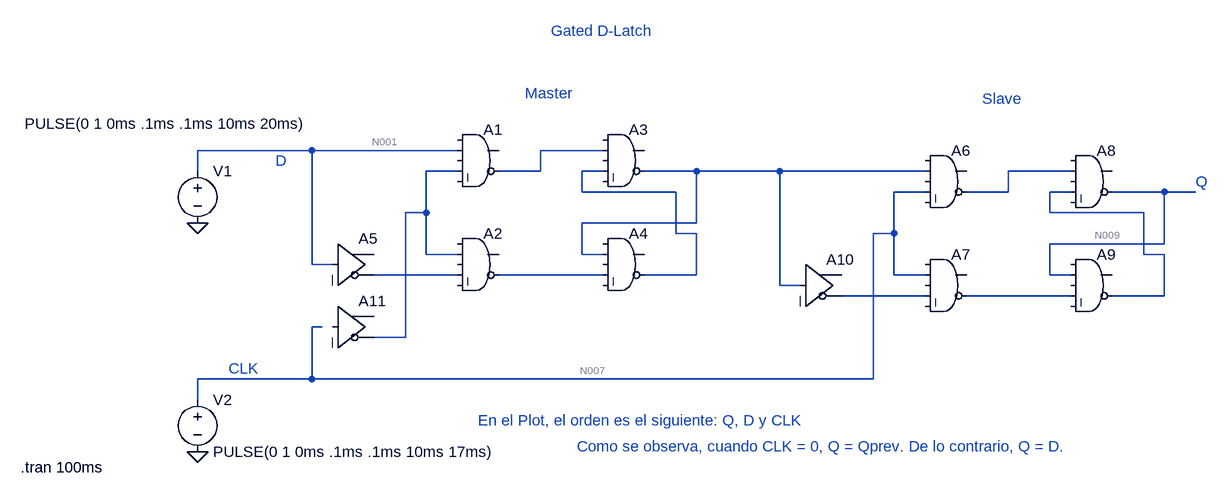
[diagram p0: schematic Lab_01_6.asc]
Lab_01_6.asc, the LTspice schematic file:
Version 4
SHEET 1 1204 680
WIRE -176 80 -352 80
WIRE 48 80 -176 80
WIRE 272 80 176 80
WIRE -352 112 -352 80
WIRE 48 112 0 112
WIRE 176 112 176 80
WIRE 176 112 112 112
WIRE 272 112 240 112
WIRE 416 112 336 112
WIRE 544 112 416 112
WIRE 768 112 544 112
WIRE 992 112 896 112
WIRE 240 144 240 112
WIRE 384 144 240 144
WIRE 768 144 720 144
WIRE 896 144 896 112
WIRE 896 144 832 144
WIRE 992 144 960 144
WIRE 1136 144 1056 144
WIRE 1184 144 1136 144
WIRE 0 176 0 112
WIRE 0 176 -32 176
WIRE 960 176 960 144
WIRE 1104 176 960 176
WIRE 416 192 416 112
WIRE 416 192 240 192
WIRE 384 208 384 144
WIRE 416 208 384 208
WIRE 720 208 720 144
WIRE 720 208 688 208
WIRE 1136 224 1136 144
WIRE 1136 224 960 224
WIRE 0 240 0 176
WIRE 48 240 0 240
WIRE 240 240 240 192
WIRE 272 240 240 240
WIRE 1104 240 1104 176
WIRE 1136 240 1104 240
WIRE -176 256 -176 80
WIRE -144 256 -176 256
WIRE 48 272 -80 272
WIRE 272 272 112 272
WIRE 416 272 416 208
WIRE 416 272 336 272
WIRE 720 272 720 208
WIRE 768 272 720 272
WIRE 960 272 960 224
WIRE 992 272 960 272
WIRE 544 288 544 112
WIRE 576 288 544 288
WIRE 768 304 640 304
WIRE 992 304 832 304
WIRE 1136 304 1136 240
WIRE 1136 304 1056 304
WIRE -160 352 -176 352
WIRE -32 368 -32 176
WIRE -32 368 -80 368
WIRE -176 432 -176 352
WIRE -176 432 -352 432
WIRE 688 432 688 208
WIRE 688 432 -176 432
WIRE -352 464 -352 432
FLAG -352 192 0
FLAG -352 544 0
SYMBOL Digital\\and 80 32 R0
SYMATTR InstName A1
SYMBOL Digital\\and 80 192 R0
SYMATTR InstName A2
SYMBOL Digital\\and 304 32 R0
SYMATTR InstName A3
SYMBOL Digital\\and 304 192 R0
SYMATTR InstName A4
SYMBOL Digital\\buf -144 192 R0
SYMATTR InstName A5
SYMBOL Digital\\and 800 64 R0
SYMATTR InstName A6
SYMBOL Digital\\and 800 224 R0
SYMATTR InstName A7
SYMBOL Digital\\and 1024 64 R0
SYMATTR InstName A8
SYMBOL Digital\\and 1024 224 R0
SYMATTR InstName A9
SYMBOL Digital\\buf 576 224 R0
SYMATTR InstName A10
SYMBOL voltage -352 96 R0
WINDOW 3 -266 -57 Left 2
WINDOW 123 0 0 Left 0
WINDOW 39 0 0 Left 0
SYMATTR Value PULSE(0 1 0ms .1ms .1ms 10ms 20ms)
SYMATTR InstName V1
SYMBOL voltage -352 448 R0
WINDOW 123 0 0 Left 0
WINDOW 39 0 0 Left 0
SYMATTR InstName V2
SYMATTR Value PULSE(0 1 0ms .1ms .1ms 10ms 17ms)
SYMBOL Digital\\buf -144 288 R0
SYMATTR InstName A11
TEXT 1184 128 Left 2 ;Q
TEXT -232 96 Left 2 ;D
TEXT -304 416 Left 2 ;CLK
TEXT 152 -8 Left 2 ;Master
TEXT 856 0 Left 2 ;Slave
TEXT -624 568 Left 2 !.tran 100ms
TEXT 80 496 Left 2 ;En el Plot, el orden es el siguiente: Q, D y CLK
TEXT 192 -104 Left 2 ;Gated D-Latch
TEXT 232 536 Left 2 ;Como se observa, cuando CLK = 0, Q = Qprev. De lo contrario, Q = D.

The netlist it stands for:
* Lab_01_6.asc
A1 0 N001 0 N003 0 N002 0 0 AND
A2 0 N003 0 N010 0 N011 0 0 AND
A3 0 N002 0 N004 0 N005 0 0 AND
A4 0 N005 0 N011 0 N004 0 0 AND
A5 N001 0 0 0 0 N010 0 0 BUF
A6 0 N005 0 N007 0 N006 0 0 AND
A7 0 N007 0 N012 0 N013 0 0 AND
A8 0 N006 0 N008 0 N009 0 0 AND
A9 0 N009 0 N013 0 N008 0 0 AND
A10 N005 0 0 0 0 N012 0 0 BUF
V1 N001 0 PULSE(0 1 0ms .1ms .1ms 10ms 20ms)
V2 N007 0 PULSE(0 1 0ms .1ms .1ms 10ms 17ms)
A11 0 0 0 0 0 N003 0 0 BUF
* Q
* D
* CLK
* Master
* Slave
.tran 100ms
* En el Plot, el orden es el siguiente: Q, D y CLK
* Gated D-Latch
* Como se observa, cuando CLK = 0, Q = Qprev. De lo contrario, Q = D.
.backanno
.end

* Results of the author's LTspice run, read from the files saved beside the schematic
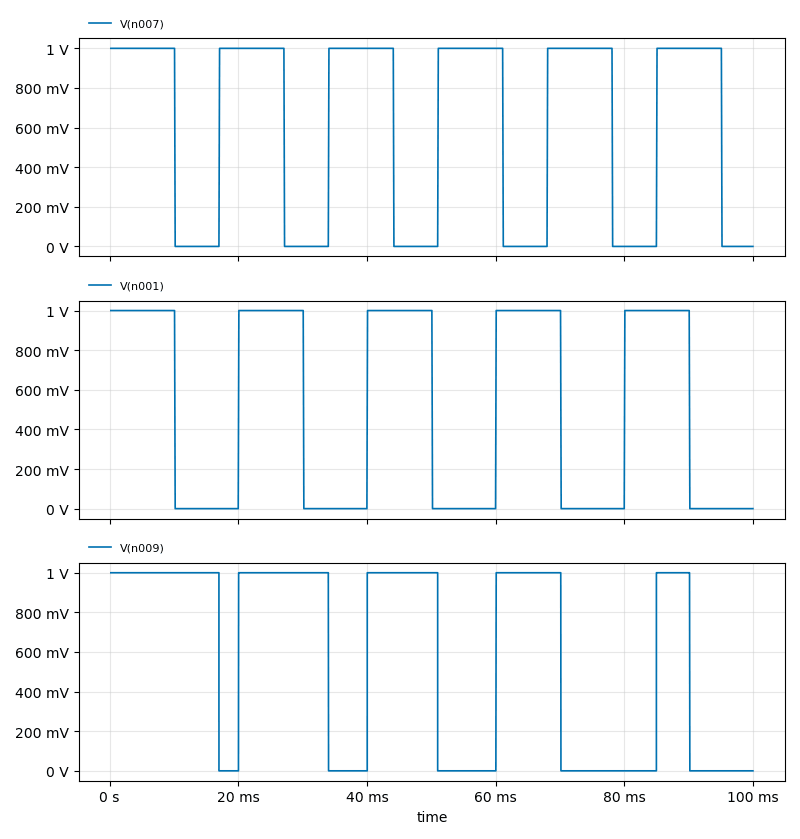
[diagram p1: Transient Analysis of Lab_01_6.asc, plotted from the saved traces]
* Transient Analysis, 1 run:
*   V(n007): min 0 V, max 1 V, average 605.7 mV, rms 777.3 mV, last 0 V
*   V(n001): min 0 V, max 1 V, average 504.5 mV, rms 709.4 mV, last 0 V
*   V(n009): min 0 V, max 1 V, average 570.9 mV, rms 755.6 mV, last 0 V